# Altium schematic sheet Schematic.SchDoc
size A4; SheetNumber: 1; SheetTotal: 1
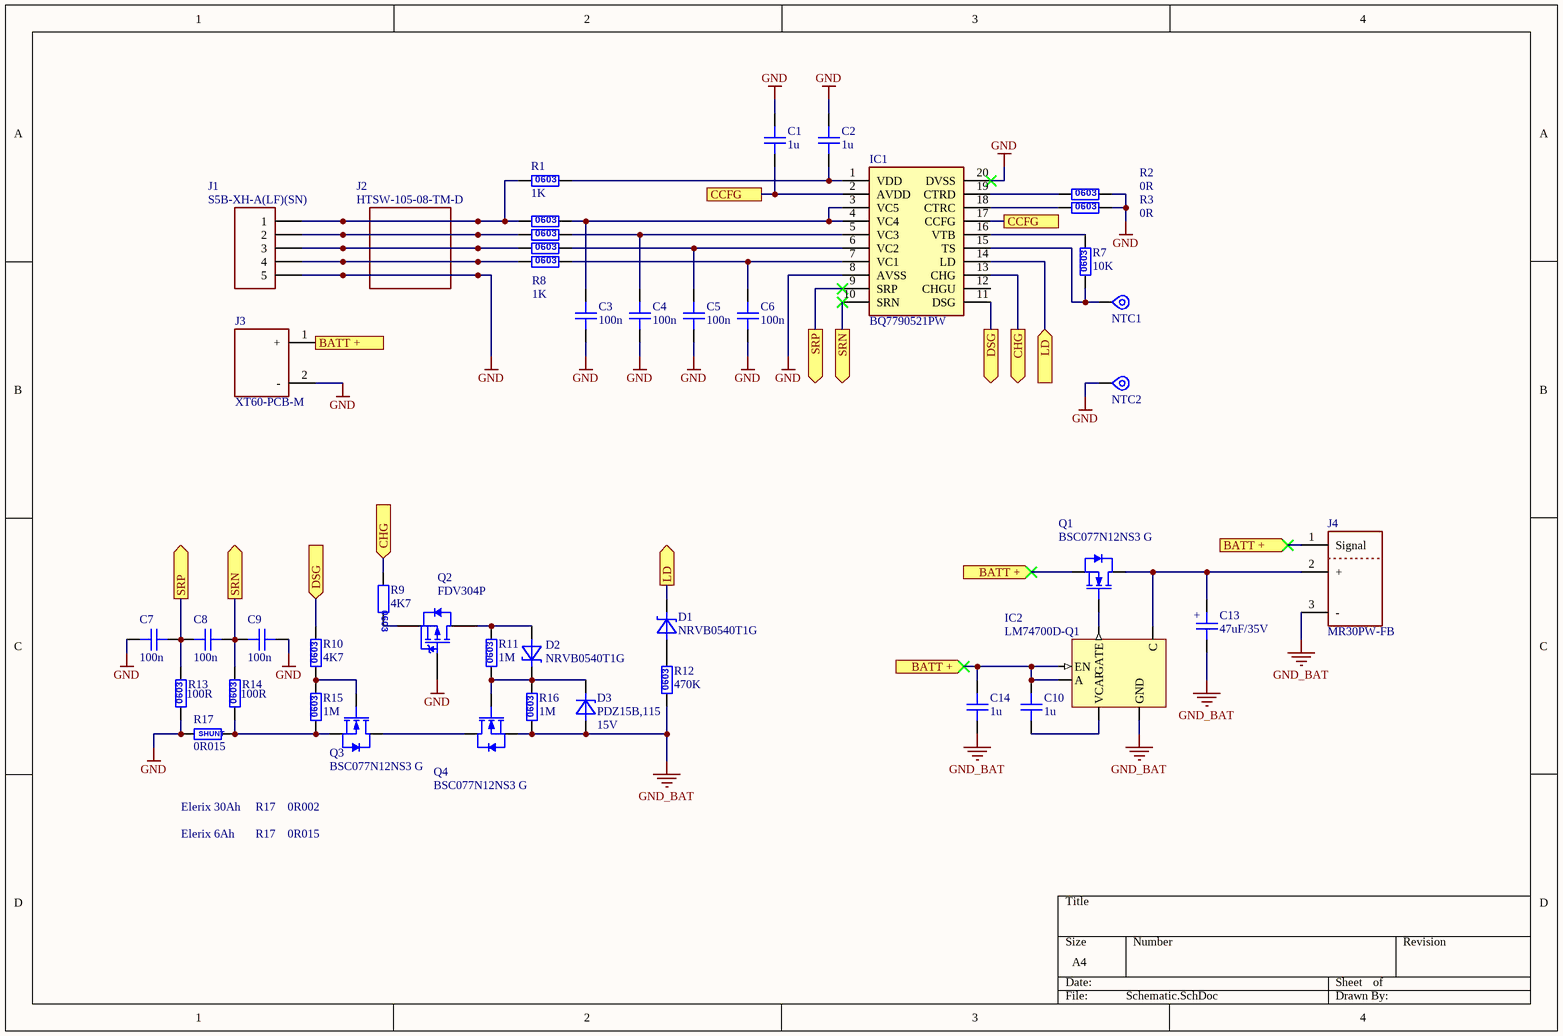
[diagram p0: Schematic.SchDoc]

## Parts
C1  value 1u  [C3216_Commercial]  (hidden comment: C1206C105K5RACTU)
C2  value 1u  [C3216_Commercial]  (hidden comment: C1206C105K5RACTU)
C3  value 100n  [C0603]  (hidden comment: 06035C104K4Z2A)
C4  value 100n  [C0603]  (hidden comment: 06035C104K4Z2A)
C5  value 100n  [C0603]  (hidden comment: 06035C104K4Z2A)
C6  value 100n  [C0603]  (hidden comment: 06035C104K4Z2A)
C7  value 100n  [C0603]  (hidden comment: 06035C104K4Z2A)
C8  value 100n  [C0603]  (hidden comment: 06035C104K4Z2A)
C9  value 100n  [C0603]  (hidden comment: 06035C104K4Z2A)
C10  value 1u  [C3216_Commercial]  (hidden comment: C1206C105K5RACTU)
C13  value 47uF/35V  [EEUFC]  (hidden comment: EEUFC1V470)
C14  value 1u  [C3216_Commercial]  (hidden comment: C1206C105K5RACTU)
D1  NRVB0540T1G  [SOD323]
D2  NRVB0540T1G  [SOD323]
D3  PDZ15B,115  value 15V  [SOD323]
IC1  BQ7790521PW  [SOP65P640X120-20N]
IC2  LM74700D-Q1  [SOIC127P600X175-8N]
J1  S5B-XH-A(LF)(SN)  [JST_S5B-XH-A(LF)(SN)]
J2  HTSW-105-08-TM-D  [SAMTEC_HTSW-105-08-TM-D]
J3  XT60-PCB-M  [XT60-PCB-M]
J4  MR30PW-FB  [MR30PW-FB]
NTC1  TP  [Pad0.8mm MPoint big]  (value not drawn)  (no BOM)
NTC2  TP  [Pad0.8mm MPoint big]  (value not drawn)  (no BOM)
Q1  BSC077N12NS3 G  [Power56_LFPAK]
Q2  FDV304P  [FAIR-SOT23-3_V]
Q3  BSC077N12NS3 G  [Power56_LFPAK]
Q4  BSC077N12NS3 G  [Power56_LFPAK]
R1  value 1K  [R0603]  (hidden comment: ERJ-3EKF1002V)
R2  value 0R  [R0603]  (hidden comment: CR0603-J/-000ELF)
R3  value 0R  [R0603]  (hidden comment: CR0603-J/-000ELF)
R4  ERJ-3EKF1002V  [R0603]  (value not drawn)
R5  ERJ-3EKF1002V  [R0603]  (value not drawn)
R6  ERJ-3EKF1002V  [R0603]  (value not drawn)
R7  value 10K  [R0603]  (hidden comment: CRGP0603F10K)
R8  value 1K  [R0603]  (hidden comment: ERJ-3EKF1002V)
R9  value 4K7  [R0603]  (hidden comment: RC0603FR-074K7L)
R10  value 4K7  [R0603]  (hidden comment: RC0603FR-074K7L)
R11  value 1M  [R0603]  (hidden comment: RC0603JR-071ML)
R12  value 470K  [R0603]  (hidden comment: CRGCQ0603F470K)
R13  value 100R  [R0603]  (hidden comment: RC0603FR-07100RL)
R14  value 100R  [R0603]  (hidden comment: RC0603FR-07100RL)
R15  value 1M  [R0603]  (hidden comment: RC0603JR-071ML)
R16  value 1M  [R0603]  (hidden comment: RC0603JR-071ML)
R17  value 0R015  [Shunt_2512]  (hidden comment: GMR100HTBFER015)

## Ports
BATT + (in, see Schematic[1B], Schematic[3C]), BATT + (in, see Schematic[1B], Schematic[3C], Schematic[4C]), BATT + (out, see Schematic[3C], Schematic[4C]), CCFG (see Schematic[2A]), CCFG (see Schematic[3A]), CHG (in, see Schematic[3B]), CHG (out, see Schematic[1C]), DSG (in, see Schematic[3B]), DSG (out, see Schematic[1C]), LD (in, see Schematic[2C]), LD (out, see Schematic[3B]), SRN (out, see Schematic[1C]), SRN (out, see Schematic[3B]), SRP (out, see Schematic[1C]), SRP (out, see Schematic[3B])

## Nets
GND: C1.2 C2.2 C3.1 C4.1 C5.1 C6.1 C7.1 C9.2 IC1.8(AVSS) IC1.20(DVSS) J1.5 J2.09 J2.10 J3.2(-) NTC2.1 Q2.1(G) R2.1 R3.1 R13.2 R17.1
GND_BAT: C13.2 C14.1 D3.1(A) IC2.1(GND) J4.3(-) Q4.1,_2,_3(SOURCE) R12.2 R16.2
BATT +: C10.2 C14.2 IC2.2(EN) IC2.5(A) J3.1(+) J4.1(Signal) Q1.1,_2,_3(SOURCE) ; port BATT +
CCFG: C1.1 IC1.2(AVDD) IC1.17(CCFG) ; port CCFG
CHG: IC1.13(CHG) R9.1 ; port CHG
DSG: IC1.11(DSG) R10.1 ; port DSG
LD: D1.2(C) IC1.14(LD) ; port LD
SRN: C8.2 C9.1 IC1.10(SRN) R14.1 ; port SRN
SRP: C7.2 C8.1 IC1.9(SRP) R13.1 ; port SRP
NetC2_1: C2.1 IC1.1(VDD) R1.1
NetC3_2: C3.2 IC1.3(VC5) IC1.4(VC4) R8.1
NetC4_2: C4.2 IC1.5(VC3) R4.1
NetC5_2: C5.2 IC1.6(VC2) R5.1
NetC6_2: C6.2 IC1.7(VC1) R6.1
NetC10_1: C10.1 IC2.4(VCAP)
NetC13_1: C13.1 IC2.8(C) J4.2(+) Q1.5(DRAIN)
NetD1_1: D1.1(A) R12.1
NetD2_1: D2.1(A) Q2.3(D) R11.1
NetD2_2: D2.2(C) D3.2(C) Q4.4(GATE) R11.2 R16.1
NetIC1_15: IC1.15(TS) NTC1.1 R7.2
NetIC1_16: IC1.16(VTB) R7.1
NetIC1_18: IC1.18(CTRC) R3.2
NetIC1_19: IC1.19(CTRD) R2.2
NetIC2_6: IC2.6(GATE) Q1.4(GATE)
NetJ1_1: J1.1 J2.01 J2.02 R1.2 R8.2
NetJ1_2: J1.2 J2.03 J2.04 R4.2
NetJ1_3: J1.3 J2.05 J2.06 R5.2
NetJ1_4: J1.4 J2.07 J2.08 R6.2
NetQ2_2: Q2.2(S) R9.2
NetQ3_1, 2, 3: Q3.1,_2,_3(SOURCE) R14.2 R15.2 R17.2
NetQ3_4: Q3.4(GATE) R10.2 R15.1
NetQ3_5: Q3.5(DRAIN) Q4.5(DRAIN)

Not connected (* = marked no-connect by the designer): IC1 12(CHGU)

## Notes on the sheet
- Elerix 6Ah       R17    0R015
- Elerix 30Ah     R17    0R002
- (in symbol CR_0603_101) 0603
- (in symbol CR_0603_102) 0603
- (in symbol CR_0603_103) 0603
- (in symbol CR_0603_105) 0603
- (in symbol CR_0603_472) 0603
- (in symbol CR_0603_474) 0603
- (in symbol CR_0603_ZERO) 0603
- (in symbol EEUFC1V-470) +
- (in symbol SHUNT_2512_0R015) SHUNT

## Library data of the parts
C1 C2 C10 C14 = CC_1206_X7R_105: Ceramic Capacitor X7R 50V; Supplier 1: Mouser; Supplier 2: Digi-Key; Supplier Part Number 1: 81-GCJ31MR71H105KA2L; Supplier Part Number 2: 490-5810-1-ND; Supplier 3: Farnell; Supplier Part Number 3: 2781416
C3-C9 = CC_0603_X7R_104: Ceramic Capacitor X7R 50V; Part Number: 100n/50V X7R C0603; SMD/THD: SMD; Main: Capacitors; Status: A; Category: Capacitors CERA SMD; Manufacturer Part Number: 100n/50V X7R C0603; Component Type: Capacitors; Supplier 1: Mouser; Supplier 2: Farnell; Supplier Part Number 1: 581-06035C104K4Z2A; Supplier Part Number 2: 1833843
C13 = EEUFC1V-470: Low ESR Capacitor; SMD/THD: THT; Main: Capacitors; Category: Capacitors THT; Status: A; Component Type: Capacitors; Supplier 1: Mouser; Supplier Part Number 1: 667-EEU-FC1V470; Supplier 2: Digi-Key; Supplier Part Number 2: P11232-ND
D1 D2 = NRVB0540T1G: Schottky Diode 40V, 500mA; SMD/THD: SMD; Main: Diodes; Value: NRVB0540T1G; Category: Schottky; Status: A; Supplier 1: Mouser; Supplier Part Number 1: 863-NRVB0540T1G; Supplier 2: Farnell; Supplier Part Number 2: 2723913
D3 = PDZ15B,115: Zener Diode 15V, 400mW; SMD/THD: SMD; Main: Diodes; Category: Zener; Status: A; Supplier 1: Mouser; Supplier Part Number 1: 771-PDZ15B-T/R; Supplier 2: Farnell; Supplier Part Number 2: 1757852; Supplier 3: TME; Supplier Part Number 3: PDZ15B.115
IC1 = BQ7790521PW: 3- to 5-series Li-Ion stackable battery protector; Manufacturer_Name: Texas Instruments; Datasheet Link: https://www.ti.com/lit/ds/symlink/bq77905.pdf?ts=1621687207060&ref_url=https%253A%252F%252Fwww.ti.com%252Fstore%252Fti%252Fen%252Fp%252Fproduct%252F%253Fp%253DBQ7790521PW; Height: 1.2mm; Manufacturer_Part_Number: BQ7790521PW; Mouser Part Number: 595-BQ7790521PW; Mouser Price/Stock: https://www.mouser.co.uk/ProductDetail/Texas-Instruments/BQ7790521PW?qs=bAKSY%2FctAC4iC2ww%2F8Jy9A%3D%3D; Supplier 1: Mouser; Supplier Part Number 1: 595-BQ7790521PWR; Supplier 2: Digi-Key; Supplier Part Number 2: 296-BQ7790521PWRCT-ND; Supplier 3: Texas Instruments; Supplier Part Number 3: BQ7790521PWR
IC2 = LM74700D-Q1: Reverse Battery Protection Ideal Diode Controller
J1 = S5B-XH-A(LF)(SN): Connector Header Through Hole, Right Angle 5 position 0.098 _2.50mm_; MF: JST Sales; MP: S5B-XH-A_LF__SN_; SnapEDA_Link: https://www.snapeda.com/parts/S5B-XH-A%28LF%29%28SN%29/JST%20Sales%20America%20Inc./view-part/494428/?ref=snap; Price: None; Package: None; Availability: Unavailable; Value: *
J2 = HTSW-105-08-TM-D: HEADER, 10 CONTACTS, 2 ROWS, THROUGH HOLE, 2.54 MM; Connector Systems:Board-to-Board; Pitch Spacing:2.54mm; No. of Rows:2Rows; No. of Contacts:10Contacts; Contact Termination Type:Through Hole; Product Range:HTSW Series RoHS Compliant: Yes; MP: HTSW10508TMD; MF: Samtec; Price: None; SnapEDA_Link: https://www.snapeda.com/parts/HTSW10508TMD/Samtec/view-part/?ref=snap; Check_prices: https://www.snapeda.com/parts/HTSW10508TMD/Samtec/view-part/?ref=eda; Package: None; Availability: In Stock; Value: *
J3 = XT60-PCB-M: XT60 Connector; Manufacturer_Name: Amass; Manufacturer_Part_Number: XT30PB; Datasheet Link: https://www.tme.eu/Document/4acc913878197f8c2e30d4b8cdc47230/XT30UPB%20SPEC.pdf; Height: 10.7mm
J4 = MR30PW-FB: Connector; Supplier 1: TME; Supplier Part Number 1: MR30PW-FB
NTC1 NTC2 = TP_PCB: Test Point; Main: Mechanical; Category: Pads_Pins_Measure_Points; Stock number: --------; Component Type: Mechanical
Q1 Q3 Q4 = BSC077N12NS3 G: Single N-Channel 120V, 98A, 7.7mOhm; Manufacturer: Infineon; Main: Transistors; SMD/THD: SMD; Category: N-MOS; Value: BSC077N12NS3 G; ComponentLink1Description: Datasheet; ComponentLink1URL: http://datasheet.octopart.com/BSC077N12NS3-G-Infineon-datasheet-62293626.pdf; Status: A; Part Number: BSC077N12NS3 G; Manufacturer Part Number: BSC077N12NS3G; Component Type: Transistors; Supplier 1: Mouser; Supplier Part Number 1: 726-BSC077N12NS3GATM; Supplier 2: Digi-Key; Supplier Part Number 2: BSC077N12NS3GATMA1CT-ND
Q2 = FDV304P: P-Channel Digital FET, -25 V, -0.46 A, 0.35 W, -55 to 150 degC, 3-Pin SOT-23, -55 to 150 degC, RoHS, Tape and Reel; Manufacturer: ON Semiconductor / Fairchild; Rad Hard: No; Typical Fall Time: 35ns; Typical Rise Time: 8ns; Channel Mode: Enhancement; Maximum Continuous Drain Current: 0.46A; RDS-on: 1100@4.5VmOhm; Maximum Drain Source Voltage: 25V; Package Version: Rev. 12, 03/2016; Typical Turn-On Delay Time: 6ns; Maximum Gate Source Voltage: 8V; Channel Type: P; Typical Turn-Off Delay Time: 55ns; Datasheet Version: Rev. E1, 08/1997; Package Description: 3-Pin Small Outline Transistor, Body 2.92 x 1.325 mm, Pitch 0.95 mm; Operating Temperature: -55to150°C; Package Reference: SOT23-3; Manufacturer URL: https://www.fairchildsemi.com/; Package URL: http://www.fairchildsemi.com/dwg/MA/MA03D.pdf; Package: 3SOT-23; Category: MOSFET; Packaging: Tape&Reel; Mounting: SurfaceMount; Datasheet URL: https://www.fairchildsemi.com/datasheets/FD/FDV304P.pdf; Mounting Technology: SurfaceMount; Manufacturer Part Number: FDV304P; Supplier 1: Digi-Key; Supplier 2: Digi-Key; Supplier Part Number 2: FDV304PDKR-ND; Supplier Part Number 1: FDV304PCT-ND
R1 R8 = CR_0603_102: Resistor 1%, 0.1W, 75V; SMD/THD: SMD; Main: Resistors; Status: A; Category: Resistors SMD; Component Type: Resistors; Supplier 1: Mouser; Supplier 2: Digi-Key; Supplier 3: Farnell; Supplier Part Number 1: 667-ERJ-3EKF1002V; Supplier Part Number 2: P10.0KHCT-ND; Supplier Part Number 3: 2303192
R2 R3 = CR_0603_ZERO: Resistor Jumper; SMD/THD: SMD; Main: Resistors; Status: A; Category: Resistors SMD; Component Type: Resistors; Supplier 1: Mouser; Supplier Part Number 1: 652-CR0603-J/-000ELF
R4-R6 = CR_0603_102: Resistor 1%, 0.1W, 75V; SMD/THD: SMD; Main: Resistors; Value: 1K; Status: A; Category: Resistors SMD; Component Type: Resistors; Supplier 1: Mouser; Supplier 2: Digi-Key; Supplier 3: Farnell; Supplier Part Number 1: 667-ERJ-3EKF1002V; Supplier Part Number 2: P10.0KHCT-ND; Supplier Part Number 3: 2303192
R7 = CR_0603_103: Resistor 1%, 0.1W, 75V; SMD/THD: SMD; Main: Resistors; Status: A; Category: Resistors SMD; Component Type: Resistors; Supplier 1: Mouser; Supplier 2: Digi-Key; Supplier 3: Farnell; Supplier Part Number 3: 2861046; Supplier Part Number 2: A130428CT-ND; Supplier Part Number 1: 279-CRGP0603F10K
R9 R10 = CR_0603_472: Resistor 1%, 0.1W, 75V; SMD/THD: SMD; Main: Resistors; Status: A; Category: Resistors SMD; Component Type: Resistors; Supplier 1: Mouser; Supplier 2: Farnell; Supplier 3: TME; Supplier Part Number 1: 603-RC0603FR-074K7L; Supplier Part Number 2: 9238565; Supplier Part Number 3: RC0603FR-074K7
R11 R15 R16 = CR_0603_105: Resistor 1%, 0.1W, 75V; Part Number: 1M0 R0603; SMD/THD: SMD; Main: Resistors; Status: A; Category: Resistors SMD; Manufacturer Part Number: 1M0 R0603; Component Type: Resistors; Supplier 1: Mouser; Supplier 2: TME; Supplier 3: Digi-Key; Supplier Part Number 2: RC0603JR-071M; Supplier Part Number 1: 603-RC0603JR-071ML; Supplier Part Number 3: 311-1.0MGRCT-ND
R12 = CR_0603_474: Resistor 1%, 0.1W, 75V; SMD/THD: SMD; Main: Resistors; Status: A; Category: Resistors SMD; Component Type: Resistors; Supplier 1: Mouser; Supplier 2: Digi-Key; Supplier 3: TME; Supplier Part Number 2: A129720CT-ND; Supplier Part Number 1: 279-CRGCQ0603F470K; Supplier Part Number 3: CRGCQ0603F470K
R13 R14 = CR_0603_101: Resistor 1%, 0.1W, 75V; SMD/THD: SMD; Main: Resistors; Status: A; Category: Resistors SMD; Component Type: Resistors; Supplier 1: Mouser; Supplier 2: Farnell; Supplier 3: TME; Supplier Part Number 1: 603-RC0603FR-07100RL; Supplier Part Number 3: RC0603FR-07100R; Supplier Part Number 2: 9238360
R17 = SHUNT_2512_0R015: Current Sense Resistor 1%, 3W, AEC-Q200; SMD/THD: SMD; Main: Resistors; Status: A; Category: Resistors SMD; Component Type: Resistors; Supplier 1: Mouser; Supplier Part Number 1: 755-GMR100HTBFER015; Supplier 2: Digi-Key; Supplier Part Number 2: 511-1687-1-ND; Supplier 3: Farnell; Supplier Part Number 3: 2808331